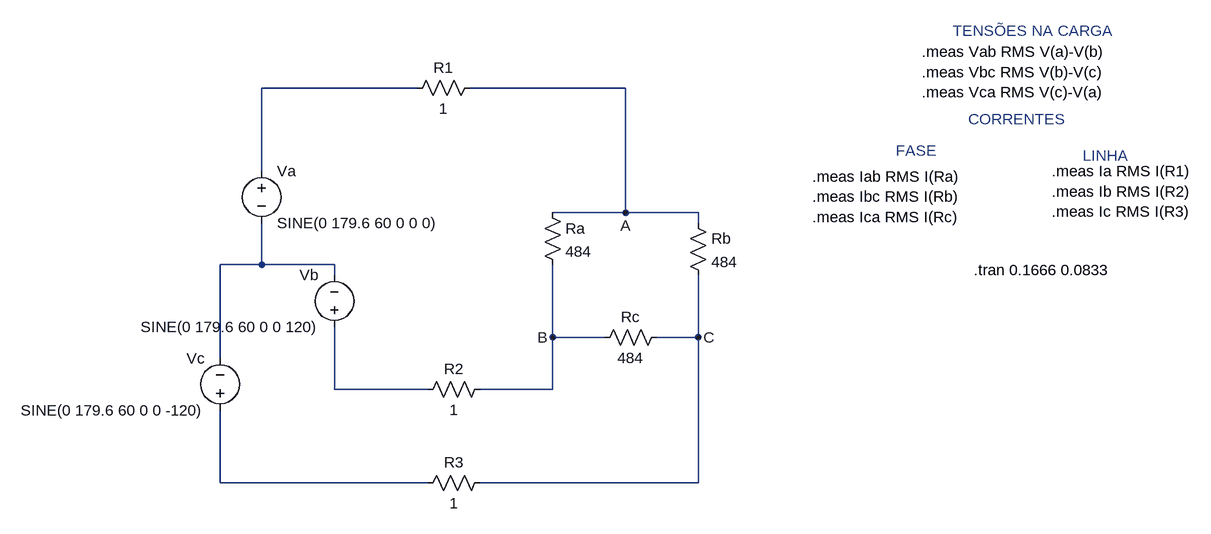
[diagram p0: schematic Y - delta eq.asc]
Y - delta eq.asc, the LTspice schematic file:
Version 4.1
SHEET 1 1620 680
WIRE 256 -64 16 -64
WIRE 576 -64 336 -64
WIRE 16 64 16 -64
WIRE 576 128 576 -64
WIRE 576 128 464 128
WIRE 688 128 576 128
WIRE 688 144 688 128
WIRE 16 208 16 144
WIRE 16 208 -48 208
WIRE 128 208 16 208
WIRE 128 224 128 208
WIRE 464 320 464 208
WIRE 544 320 464 320
WIRE 688 320 688 224
WIRE 688 320 624 320
WIRE -48 352 -48 208
WIRE 128 400 128 304
WIRE 272 400 128 400
WIRE 464 400 464 320
WIRE 464 400 352 400
WIRE -48 544 -48 432
WIRE 272 544 -48 544
WIRE 688 544 688 320
WIRE 688 544 352 544
FLAG 576 128 A
FLAG 464 320 B
FLAG 688 320 C
SYMBOL voltage 16 48 R0
WINDOW 123 0 0 Left 0
WINDOW 39 0 0 Left 0
SYMATTR InstName Va
SYMATTR Value SINE(0 179.6 60 0 0 0)
SYMBOL voltage 128 320 R180
WINDOW 0 24 96 Left 2
WINDOW 3 24 16 Left 2
WINDOW 123 0 0 Left 0
WINDOW 39 0 0 Left 0
SYMATTR InstName Vb
SYMATTR Value SINE(0 179.6 60 0 0 120)
SYMBOL voltage -48 448 R180
WINDOW 0 24 96 Left 2
WINDOW 3 24 16 Left 2
WINDOW 123 0 0 Left 0
WINDOW 39 0 0 Left 0
SYMATTR InstName Vc
SYMATTR Value SINE(0 179.6 60 0 0 -120)
SYMBOL res 448 112 R0
SYMATTR InstName Ra
SYMATTR Value 484
SYMBOL res 672 128 R0
SYMATTR InstName Rb
SYMATTR Value 484
SYMBOL res 640 304 R90
WINDOW 0 0 56 VBottom 2
WINDOW 3 32 56 VTop 2
SYMATTR InstName Rc
SYMATTR Value 484
SYMBOL res 352 -80 R90
WINDOW 0 0 56 VBottom 2
WINDOW 3 32 56 VTop 2
SYMATTR InstName R1
SYMATTR Value 1
SYMBOL res 368 384 R90
WINDOW 0 0 56 VBottom 2
WINDOW 3 32 56 VTop 2
SYMATTR InstName R2
SYMATTR Value 1
SYMBOL res 368 528 R90
WINDOW 0 0 56 VBottom 2
WINDOW 3 32 56 VTop 2
SYMATTR InstName R3
SYMATTR Value 1
TEXT 1080 -152 Left 2 ;TENSÕES NA CARGA
TEXT 1032 -120 Left 2 !.meas Vab RMS V(a)-V(b)\n.meas Vbc RMS V(b)-V(c)\n.meas Vca RMS V(c)-V(a)
TEXT 1104 -16 Left 2 ;CORRENTES
TEXT 992 32 Left 2 ;FASE
TEXT 864 72 Left 2 !.meas Iab RMS I(Ra)\n.meas Ibc RMS I(Rb)\n.meas Ica RMS I(Rc)
TEXT 1280 40 Left 2 ;LINHA
TEXT 1232 64 Left 2 !.meas Ia RMS I(R1)\n.meas Ib RMS I(R2)\n.meas Ic RMS I(R3)
TEXT 1112 216 Left 2 !.tran 0.1666 0.0833

The netlist it stands for:
* Y - delta eq.asc
Va N001 N002 SINE(0 179.6 60 0 0 0)
Vb N003 N002 SINE(0 179.6 60 0 0 120)
Vc N004 N002 SINE(0 179.6 60 0 0 -120)
Ra A B 484
Rb A C 484
Rc C B 484
R1 A N001 1
R2 B N003 1
R3 C N004 1
* TENSÕES NA CARGA
.meas Vab RMS V(a)-V(b)
.meas Vbc RMS V(b)-V(c)
.meas Vca RMS V(c)-V(a)
* CORRENTES
* FASE
.meas Iab RMS I(Ra)
.meas Ibc RMS I(Rb)
.meas Ica RMS I(Rc)
* LINHA
.meas Ia RMS I(R1)
.meas Ib RMS I(R2)
.meas Ic RMS I(R3)
.tran 0.1666 0.0833
.backanno
.end

* Results of the author's LTspice run, read from the files saved beside the schematic
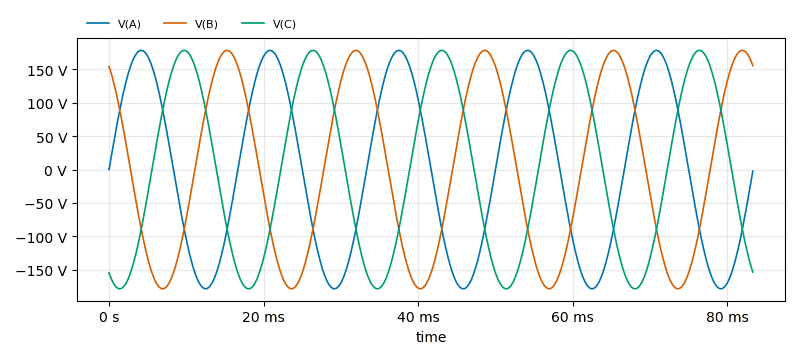
[diagram p1: Transient Analysis of Y - delta eq.asc, plotted from the saved traces]
* Transient Analysis, 1 run:
*   V(A): min -178.5 V, max 178.5 V, average -720.4 µV, rms 126.2 V, last -2.257 V
*   V(B): min -178.5 V, max 178.5 V, average -63.29 mV, rms 126.2 V, last 155.7 V
*   V(C): min -178.5 V, max 178.5 V, average 60.12 mV, rms 126.2 V, last -153.5 V
* From the log:
*   vab: RMS(V(a)-V(b))=218.613131347 FROM 0 TO 0.0833
*   vbc: RMS(V(b)-V(c))=218.547624545 FROM 0 TO 0.0833
*   vca: RMS(V(c)-V(a))=218.613930993 FROM 0 TO 0.0833
*   iab: RMS(I(Ra))=0.451680022876 FROM 0 TO 0.0833
*   ibc: RMS(I(Rb))=0.451681675418 FROM 0 TO 0.0833
*   ica: RMS(I(Rc))=0.451544678477 FROM 0 TO 0.0833
*   ia: RMS(I(R1))=0.782412781942 FROM 0 TO 0.0833
*   ib: RMS(I(R2))=0.782175519004 FROM 0 TO 0.0833
*   ic: RMS(I(R3))=0.78217838367 FROM 0 TO 0.0833